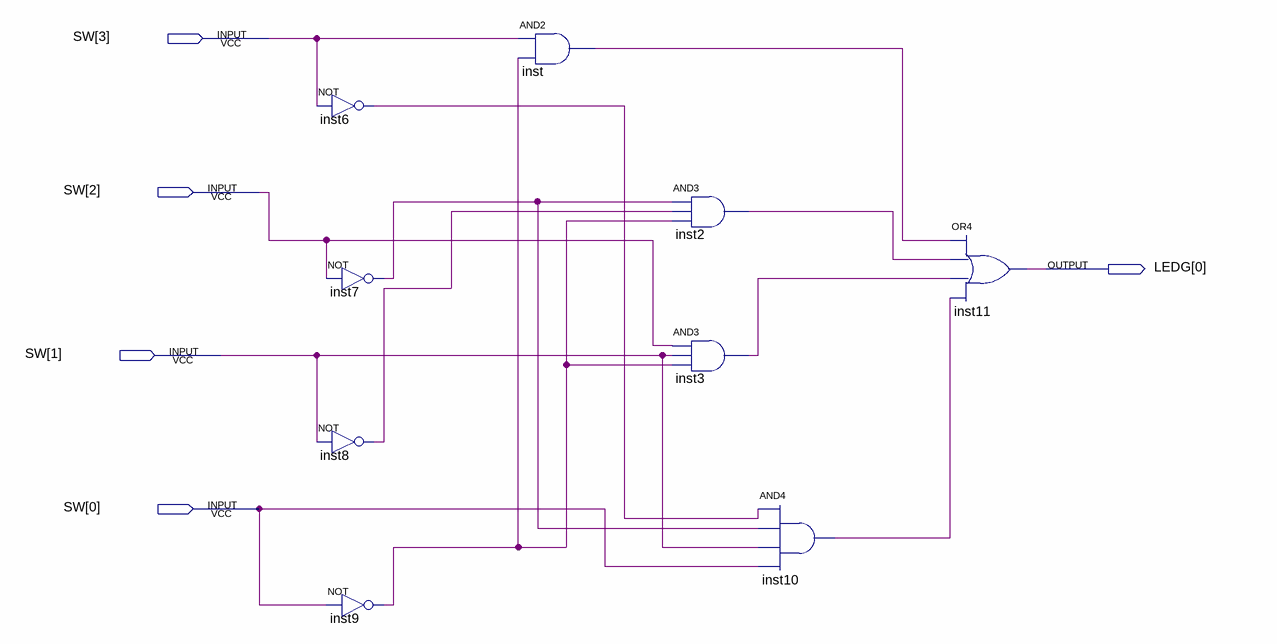
[diagram p0: schematic sheet]
// Quartus schematic lab02.bdf as structural Verilog: 9 symbols, 5 pins
module lab02 (
  input  [3:0] SW,
  output [0:0] LEDG
);

  wire inst2_out, inst3_out, inst6_out, inst7_out, inst8_out, inst9_out, inst10_out, inst_out;

  not inst6 (inst6_out, SW[3]);
  not inst7 (inst7_out, SW[2]);
  not inst8 (inst8_out, SW[1]);
  not inst9 (inst9_out, SW[0]);
  and inst (inst_out, SW[3], inst9_out);
  and inst2 (inst2_out, inst7_out, inst8_out, inst9_out);
  and inst3 (inst3_out, SW[2], SW[1], inst9_out);
  and inst10 (inst10_out, inst6_out, inst7_out, SW[1], SW[0]);
  or inst11 (LEDG[0], inst_out, inst2_out, inst3_out, inst10_out);
endmodule
